# Altium project PCB_Project_1.PrjPcb
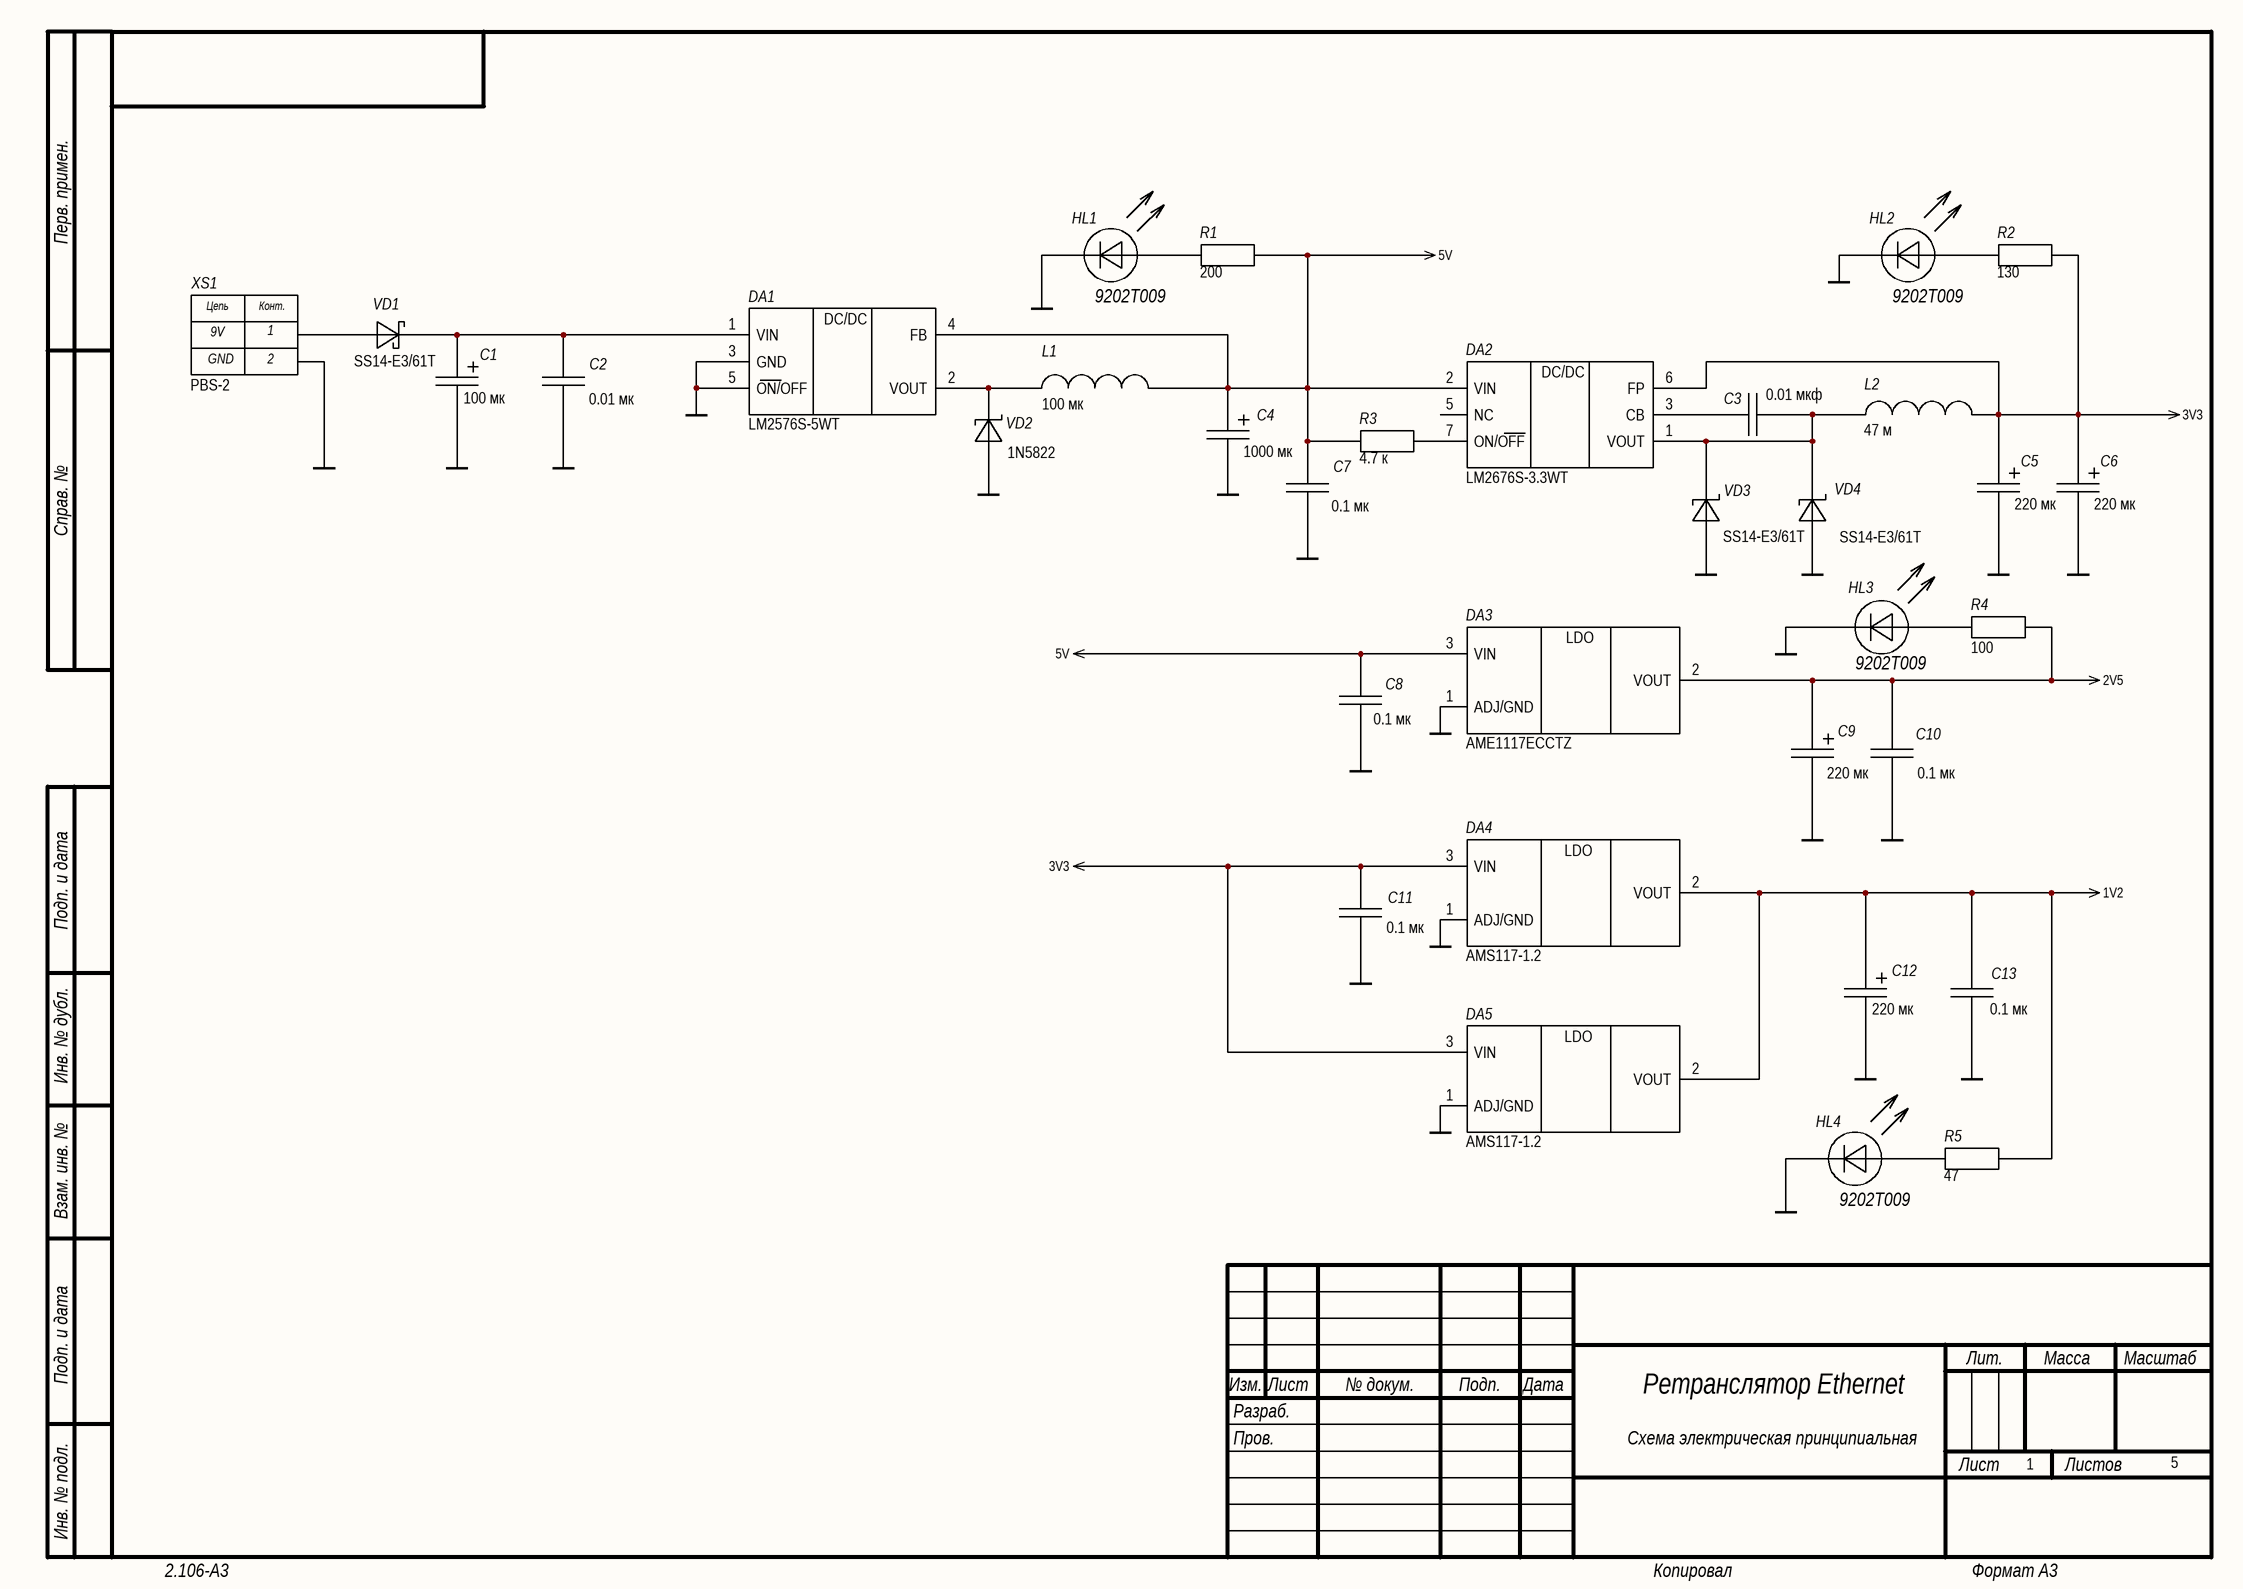
[diagram p0: Power.SchDoc]
5 sheets, 181 parts. Net scope: global (net labels, ports and power ports of the same name join across sheets).
Sheets:
  Power.SchDoc
  Ethernet.SchDoc
  PLIS_POWER.SchDoc
  LCD.SchDoc
  PROGRAM.SchDoc

## Sheet Power.SchDoc
size 420 x 297 mm; CompanyName3: МГТУ им. Н.Э. Баумана; Address1: Address1; Address2: Address2; Address3: Address3; Address4: Address4; DocumentNumber: Э3; Revision: р; SheetNumber: 1; SheetTotal: 5; Title1str: Ретранслятор Ethernet; DocumentType: Схема электрическая принципиальная; FirstReferrence: АБВГ.123456.001; CompanyName2: Кафедра СМ5; CompanyName1: Группа СМ5-71

### Parts
C1  (no value)
C2  (no value)
C3  (no value)
C4  (no value)
C5  (no value)
C6  (no value)
C7  (no value)
C8  (no value)
C9  (no value)
C10  (no value)
C11  (no value)
C12  (no value)
C13  (no value)
DA1  LM2576S-5WT
DA2  LM2676S-3.3WT
DA3  AME1117ECCTZ
DA4  AMS117-1.2
DA5  AMS117-1.2
HL1  9202T009
HL2  9202T009
HL3  9202T009
HL4  9202T009
L1  L  (value not drawn)
L2  L  (value not drawn)
R1  200
R2  130
R3  4.7 к
R4  100
R5  47
VD1  *  (value not drawn)
VD2  *  (value not drawn)
VD3  *  (value not drawn)
VD4  *  (value not drawn)
XS1  Header  (value not drawn)

### Nets
1V2: C12.2 C13.2 DA4.2(VOUT) DA5.2(VOUT) R5.1
2V5: C9.2 C10.2 DA3.2(VOUT) R4.1
3V3: C5.2 C6.2 C11.2 DA2.6(FP) DA4.3(VIN) DA5.3(VIN) L2.2 R2.1
5V: C4.2 C7.2 C8.2 DA1.4(FB) DA2.2(VIN) DA3.3(VIN) L1.2 R1.1 R3.2
GND: C1.1 C2.1 C5.1 C6.1 C7.1 C8.1 C9.1 C10.1 C11.1 C12.1 C13.1 DA1.3(GND) DA1.5(ON/OFF) DA3.1(ADJ/GND) DA4.1(ADJ/GND) DA5.1(ADJ/GND) HL1.2 HL2.2 HL3.2 HL4.2 VD2.1 VD3.1 VD4.1 XS1.2
NetC1_2: C1.2 C2.2 DA1.1(VIN) VD1.2
NetC3_1: C3.1 DA2.1(VOUT) L2.1 VD3.2 VD4.2
NetC3_2: C3.2 DA2.3(CB)
NetDA1_2: DA1.2(VOUT) L1.1 VD2.2
NetDA2_7: DA2.7(ON/OFF) R3.1
NetHL1_1: HL1.1 R1.2
NetHL2_1: HL2.1 R2.2
NetHL3_1: HL3.1 R4.2
NetHL4_1: HL4.1 R5.2
NetVD1_1: VD1.1 XS1.1

Not connected (* = marked no-connect by the designer): C4 1; DA2 5(NC)

### Notes on the sheet
- PBS-2
- SS14-E3/61T
- (near C1) 100 мк
- (near C2) 0.01 мк
- (near VD2) 1N5822
- (near L1) 100 мк
- (near C7) 1000 мк
- (near C3) 0.01 мкф
- (near L2) 47 м
- (near C7) 0.1 мк
- 220 мк
- (near C6) 220 мк
- (near VD4) SS14-E3/61T
- (near C8) 0.1 мк
- (near C10) 0.1 мк
- 0.1 мк
- (near C12) 220 мк
- (near C13) 0.1 мк
- 1
- 5
- Labels drawn without touching a wire or pin: GND
- Перв. примен.
- Справ. №
- Подп. и дата
- Инв. № дубл.
- Взам. инв. №
- Разраб.
- Изм.
- Лист
- № докум.
- Подп.
- Дата
- Ретранслятор Ethernet
- Лит.
- Масса
- Масштаб
- Пров.
- Схема электрическая принципиальная
- Листов
- Инв. № подл.
- 2.106-A3
- Копировал
- Формат А3
- (in symbol AME1117ACCTZ_LDO_1.2v) LDO
- (in symbol AME1117ECCTZ_LDO_1.8v) LDO
- (in symbol Header) Цепь; Конт.; 9V; GND
- (in symbol LM2576_DCDC) DC/DC
- (in symbol LM2676_LDO_3v3) DC/DC

### Library data of the parts
C1 C4-C6 C9 C12 = C_POL: ValueType: Конденсатор
C2 C3 C7 C8 C10 C11 C13 = C: ValueType: Конденсатор
DA1 = LM2576_DCDC
DA2 = LM2676_LDO_3v3
DA3 = AME1117ECCTZ_LDO_1.8v
DA4 DA5 = AME1117ACCTZ_LDO_1.2v
HL1-HL4 = Led_blue: ValueManufacturer: Foryard; ValueManufacturerPartNumber: fyls-0603urc; Temp: -40 C... +85 C; Value: Cиний; ValueType: Светодиод; URL: *; Case: 0603; ValueDescription: Светодиод
R1-R5 = R
VD1 = shotki: ValueManufacturer: On Semiconductor; ValueManufacturerPartNumber: BAT54HT1G; Value: *; URL: *; Temp: *; Case: *; ValueType: *; ValueDescription: *
VD2-VD4 = Diode: ValueManufacturer: On Semiconductor; ValueManufacturerPartNumber: BAT54HT1G; Value: *; URL: *; Temp: *; Case: *; ValueType: *; ValueDescription: *

## Sheet Ethernet.SchDoc
size 420 x 297 mm; Address1: Address1; Address2: Address2; Address3: Address3; Address4: Address4; DocumentNumber: Э3; SheetNumber: 2; SheetTotal: 5; Scale: 1:1; DocumentType: Схема электрическая принципиальная; FirstReferrence: АБВГ.123456.001
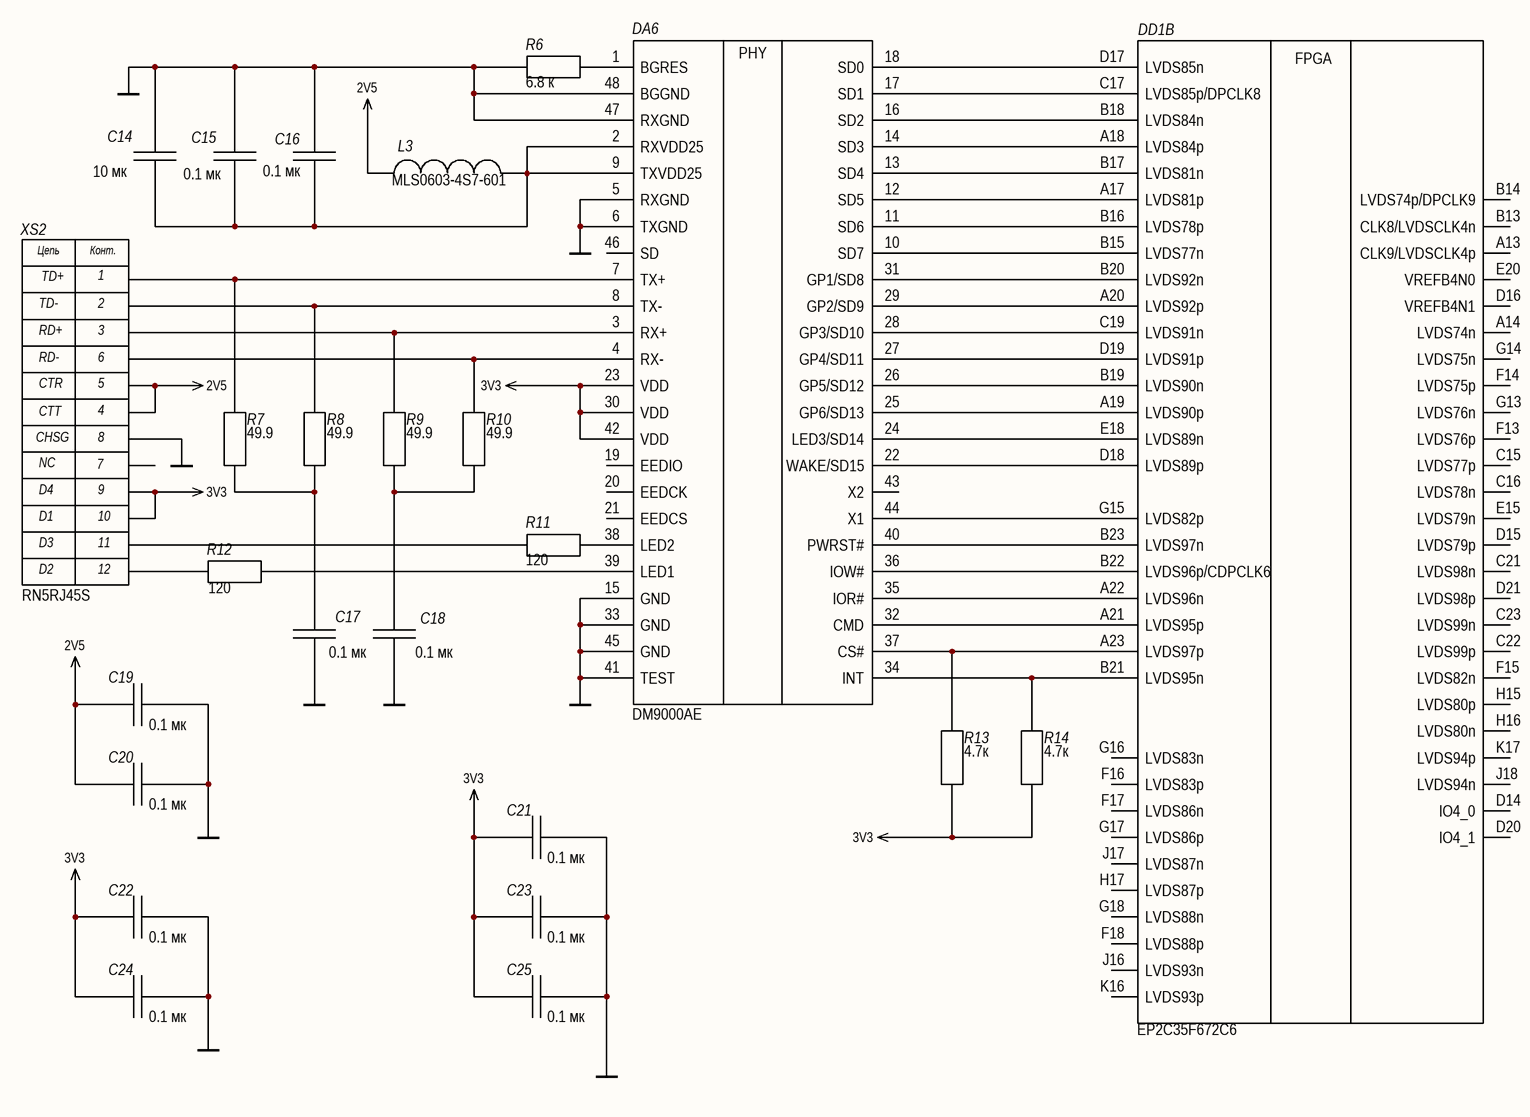
[diagram p1: Ethernet.SchDoc]

### Parts
C14  (no value)
C15  (no value)
C16  (no value)
C17  (no value)
C18  (no value)
C19  (no value)
C20  (no value)
C21  (no value)
C22  (no value)
C23  (no value)
C24  (no value)
C25  (no value)
DA6  DM9000AE
DD1  EP2C35F672C6  (part B of 7)
L3  L  (value not drawn)
R6  6.8 к
R7  49.9
R8  49.9
R9  49.9
R10  49.9
R11  120
R12  120
R13  4.7к
R14  4.7к
XS2  RN5RJ45S

### Nets
2V5: C19.2 C20.2 L3.1 XS2.4 XS2.5
3V3: C21.2 C22.2 C23.2 C24.2 C25.2 DA6.23(VDD) DA6.30(VDD) DA6.42(VDD) R13.1 R14.1 XS2.9 XS2.10
GND: C14.2 C15.2 C16.2 C17.1 C18.1 C19.1 C20.1 C21.1 C22.1 C23.1 C24.1 C25.1 DA6.5(RXGND) DA6.6(TXGND) DA6.15(GND) DA6.33(GND) DA6.41(TEST) DA6.45(GND) DA6.47(RXGND) DA6.48(BGGND) R6.1 XS2.8
NetC14_1: C14.1 C15.1 C16.1 DA6.2(RXVDD25) DA6.9(TXVDD25) L3.2
NetC17_2: C17.2 R7.1 R8.1
NetC18_2: C18.2 R9.1 R10.1
NetDA6_1: DA6.1(BGRES) R6.2
NetDA6_3: DA6.3(RX+) R9.2 XS2.3
NetDA6_4: DA6.4(RX-) R10.2 XS2.6
NetDA6_7: DA6.7(TX+) R7.2 XS2.1
NetDA6_8: DA6.8(TX-) R8.2 XS2.2
NetDA6_10: DA6.10(SD7) DD1.B15(LVDS77n)
NetDA6_11: DA6.11(SD6) DD1.B16(LVDS78p)
NetDA6_12: DA6.12(SD5) DD1.A17(LVDS81p)
NetDA6_13: DA6.13(SD4) DD1.B17(LVDS81n)
NetDA6_14: DA6.14(SD3) DD1.A18(LVDS84p)
NetDA6_16: DA6.16(SD2) DD1.B18(LVDS84n)
NetDA6_17: DA6.17(SD1) DD1.C17(LVDS85p/DPCLK8)
NetDA6_18: DA6.18(SD0) DD1.D17(LVDS85n)
NetDA6_22: DA6.22(WAKE/SD15) DD1.D18(LVDS89p)
NetDA6_24: DA6.24(LED3/SD14) DD1.E18(LVDS89n)
NetDA6_25: DA6.25(GP6/SD13) DD1.A19(LVDS90p)
NetDA6_26: DA6.26(GP5/SD12) DD1.B19(LVDS90n)
NetDA6_27: DA6.27(GP4/SD11) DD1.D19(LVDS91p)
NetDA6_28: DA6.28(GP3/SD10) DD1.C19(LVDS91n)
NetDA6_29: DA6.29(GP2/SD9) DD1.A20(LVDS92p)
NetDA6_31: DA6.31(GP1/SD8) DD1.B20(LVDS92n)
NetDA6_32: DA6.32(CMD) DD1.A21(LVDS95p)
NetDA6_34: DA6.34(INT) DD1.B21(LVDS95n) R14.2
NetDA6_35: DA6.35(IOR#) DD1.A22(LVDS96n)
NetDA6_36: DA6.36(IOW#) DD1.B22(LVDS96p/CDPCLK6)
NetDA6_37: DA6.37(CS#) DD1.A23(LVDS97p) R13.2
NetDA6_38: DA6.38(LED2) R11.2
NetDA6_39: DA6.39(LED1) R12.2
NetDA6_40: DA6.40(PWRST#) DD1.B23(LVDS97n)
NetDA6_44: DA6.44(X1) DD1.G15(LVDS82p)
NetR11_1: R11.1 XS2.11
NetR12_1: R12.1 XS2.12

Not connected (* = marked no-connect by the designer): DA6 19(EEDIO) 20(EEDCK) 21(EEDCS) 43(X2) 46(SD); DD1 A13(CLK9/LVDSCLK4p) A14(LVDS74n) B13(CLK8/LVDSCLK4n) B14(LVDS74p/DPCLK9) C15(LVDS77p) C16(LVDS78n) C21(LVDS98n) C22(LVDS99p) C23(LVDS99n) D14(IO4_0) D15(LVDS79p) D16(VREFB4N1) D20(IO4_1) D21(LVDS98p) E15(LVDS79n) E20(VREFB4N0) F13(LVDS76p) F14(LVDS75p) F15(LVDS82n) F16(LVDS83p) F17(LVDS86n) F18(LVDS88p) G13(LVDS76n) G14(LVDS75n) G16(LVDS83n) G17(LVDS86p) G18(LVDS88n) H15(LVDS80p) H16(LVDS80n) H17(LVDS87p) J16(LVDS93n) J17(LVDS87n) J18(LVDS94n) K16(LVDS93p) K17(LVDS94p); XS2 7

### Notes on the sheet
- (near C14) 10 мк
- (near C15) 0.1 мк
- (near C16) 0.1 мк
- (near L3) MLS0603-4S7-601
- 0.1 мк
- (near C18) 0.1 мк
- (near C19) 0.1 мк
- (near C20) 0.1 мк
- (near C21) 0.1 мк
- (near C22) 0.1 мк
- (near C23) 0.1 мк
- (near C24) 0.1 мк
- (near C25) 0.1 мк
- Подп. и дата
- Инв. № дубл.
- Взам. инв. №
- Инв. № подл.
- Изм.
- Лист
- № докум.
- Подп.
- Дата
- 2.106-A3
- Копировал
- Формат А3
- (in symbol DM9000AE) PHY
- (in symbol Ethernet_RJ45) Цепь; Конт.; TD+; TD-; RD+; RD-; CTR; CTT; CHSG; NC; D4; D1; D3; D2
- (in symbol PLIS, part B) FPGA

### Library data of the parts
C14-C25 = C: ValueType: Конденсатор
DD1 = PLIS
R6-R14 = R
XS2 = Ethernet_RJ45

## Sheet PLIS_POWER.SchDoc
size 420 x 297 mm; Address1: Address1; Address2: Address2; Address3: Address3; Address4: Address4; DocumentNumber: Э3; SheetNumber: 3; SheetTotal: 5; Scale: 1:1; DocumentType: Схема электрическая принципиальная; FirstReferrence: АБВГ.123456.001
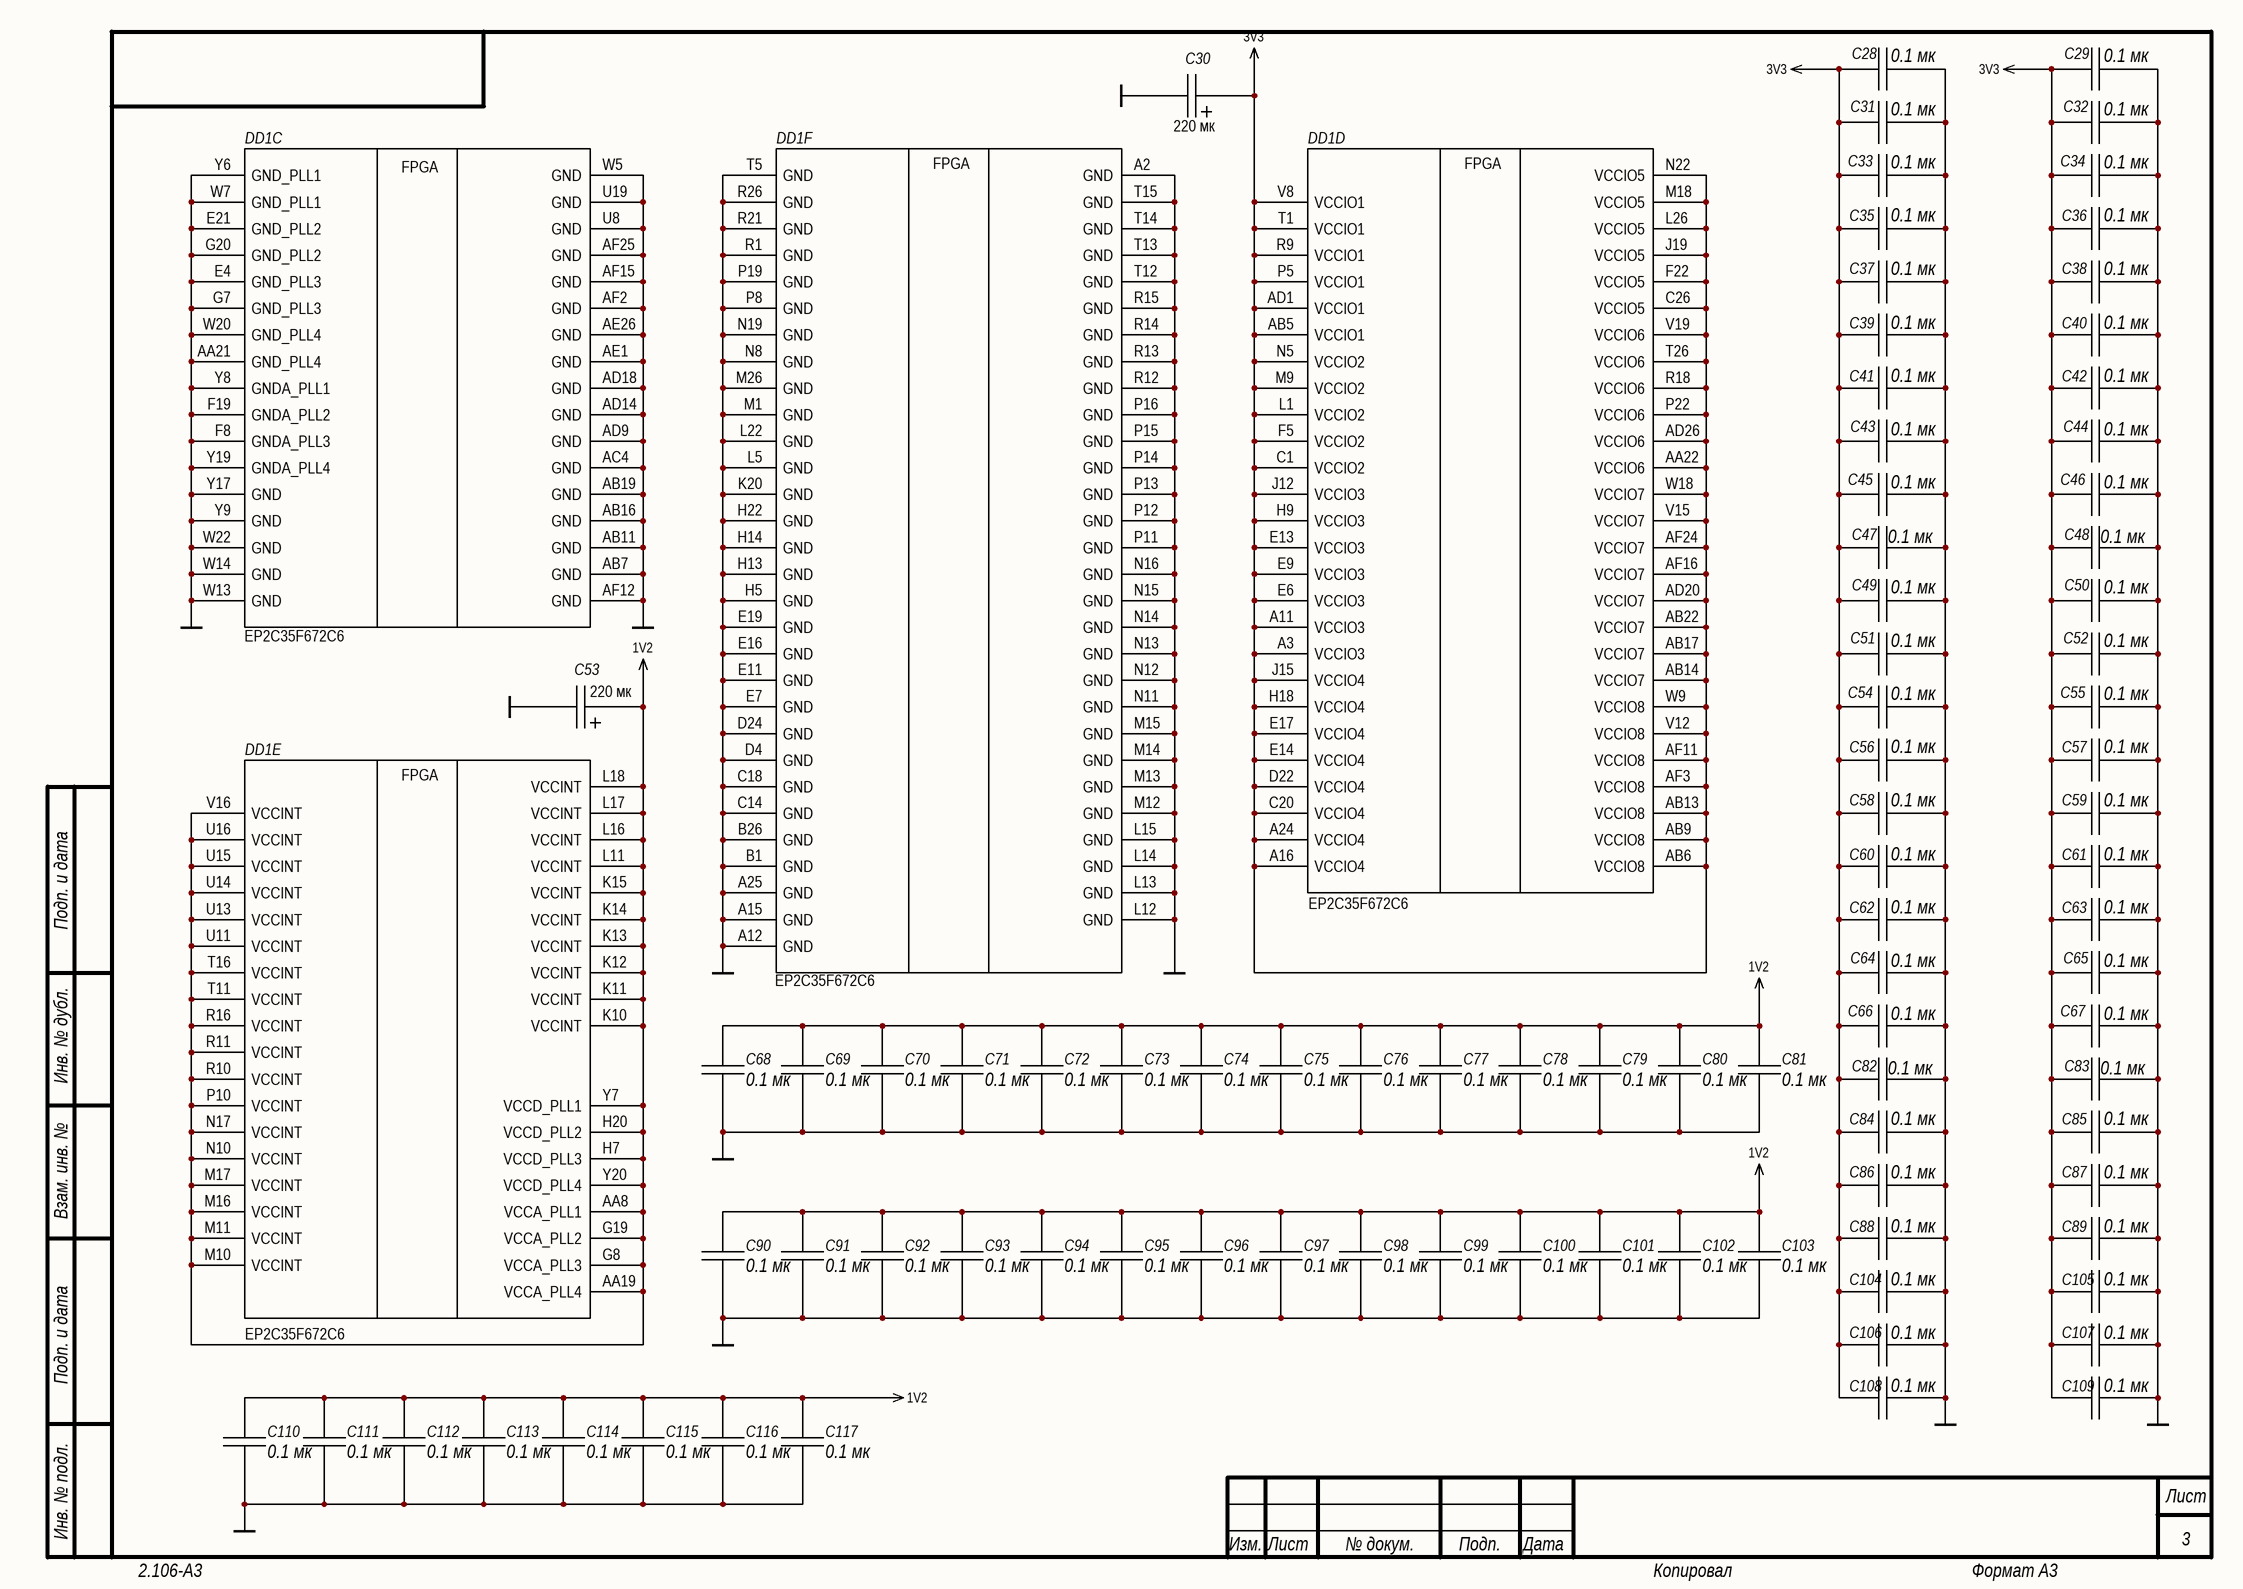
[diagram p2: PLIS_POWER.SchDoc]

### Parts
C28  0.1 мк
C29  0.1 мк
C30  (no value)
C31  0.1 мк
C32  0.1 мк
C33  0.1 мк
C34  0.1 мк
C35  0.1 мк
C36  0.1 мк
C37  0.1 мк
C38  0.1 мк
C39  0.1 мк
C40  0.1 мк
C41  0.1 мк
C42  0.1 мк
C43  0.1 мк
C44  0.1 мк
C45  0.1 мк
C46  0.1 мк
C47  0.1 мк
C48  0.1 мк
C49  0.1 мк
C50  0.1 мк
C51  0.1 мк
C52  0.1 мк
C53  (no value)
C54  0.1 мк
C55  0.1 мк
C56  0.1 мк
C57  0.1 мк
C58  0.1 мк
C59  0.1 мк
C60  0.1 мк
C61  0.1 мк
C62  0.1 мк
C63  0.1 мк
C64  0.1 мк
C65  0.1 мк
C66  0.1 мк
C67  0.1 мк
C68  0.1 мк
C69  0.1 мк
C70  0.1 мк
C71  0.1 мк
C72  0.1 мк
C73  0.1 мк
C74  0.1 мк
C75  0.1 мк
C76  0.1 мк
C77  0.1 мк
C78  0.1 мк
C79  0.1 мк
C80  0.1 мк
C81  0.1 мк
C82  0.1 мк
C83  0.1 мк
C84  0.1 мк
C85  0.1 мк
C86  0.1 мк
C87  0.1 мк
C88  0.1 мк
C89  0.1 мк
C90  0.1 мк
C91  0.1 мк
C92  0.1 мк
C93  0.1 мк
C94  0.1 мк
C95  0.1 мк
C96  0.1 мк
C97  0.1 мк
C98  0.1 мк
C99  0.1 мк
C100  0.1 мк
C101  0.1 мк
C102  0.1 мк
C103  0.1 мк
C104  0.1 мк
C105  0.1 мк
C106  0.1 мк
C107  0.1 мк
C108  0.1 мк
C109  0.1 мк
C110  0.1 мк
C111  0.1 мк
C112  0.1 мк
C113  0.1 мк
C114  0.1 мк
C115  0.1 мк
C116  0.1 мк
C117  0.1 мк
DD1  EP2C35F672C6  (parts C,D,E,F of 7)

### Nets
1V2: C53.2 C68.1 C69.1 C70.1 C71.1 C72.1 C73.1 C74.1 C75.1 C76.1 C77.1 C78.1 C79.1 C80.1 C81.1 C90.1 C91.1 C92.1 C93.1 C94.1 C95.1 C96.1 C97.1 C98.1 C99.1 C100.1 C101.1 C102.1 C103.1 C110.1 C111.1 C112.1 C113.1 C114.1 C115.1 C116.1 C117.1 DD1.AA8(VCCA_PLL1) DD1.AA19(VCCA_PLL4) DD1.G8(VCCA_PLL3) DD1.G19(VCCA_PLL2) DD1.H7(VCCD_PLL3) DD1.H20(VCCD_PLL2) DD1.K10(VCCINT) DD1.K11(VCCINT) DD1.K12(VCCINT) DD1.K13(VCCINT) DD1.K14(VCCINT) DD1.K15(VCCINT) DD1.L11(VCCINT) DD1.L16(VCCINT) DD1.L17(VCCINT) DD1.L18(VCCINT) DD1.M10(VCCINT) DD1.M11(VCCINT) DD1.M16(VCCINT) DD1.M17(VCCINT) DD1.N10(VCCINT) DD1.N17(VCCINT) DD1.P10(VCCINT) DD1.R10(VCCINT) DD1.R11(VCCINT) DD1.R16(VCCINT) DD1.T11(VCCINT) DD1.T16(VCCINT) DD1.U11(VCCINT) DD1.U13(VCCINT) DD1.U14(VCCINT) DD1.U15(VCCINT) DD1.U16(VCCINT) DD1.V16(VCCINT) DD1.Y7(VCCD_PLL1) DD1.Y20(VCCD_PLL4)
3V3: C28.1 C29.1 C30.2 C31.1 C32.1 C33.1 C34.1 C35.1 C36.1 C37.1 C38.1 C39.1 C40.1 C41.1 C42.1 C43.1 C44.1 C45.1 C46.1 C47.1 C48.1 C49.1 C50.1 C51.1 C52.1 C54.1 C55.1 C56.1 C57.1 C58.1 C59.1 C60.1 C61.1 C62.1 C63.1 C64.1 C65.1 C66.1 C67.1 C82.1 C83.1 C84.1 C85.1 C86.1 C87.1 C88.1 C89.1 C104.1 C105.1 C106.1 C107.1 C108.1 C109.1 DD1.A3(VCCIO3) DD1.A11(VCCIO3) DD1.A16(VCCIO4) DD1.A24(VCCIO4) DD1.AA22(VCCIO6) DD1.AB5(VCCIO1) DD1.AB6(VCCIO8) DD1.AB9(VCCIO8) DD1.AB13(VCCIO8) DD1.AB14(VCCIO7) DD1.AB17(VCCIO7) DD1.AB22(VCCIO7) DD1.AD1(VCCIO1) DD1.AD20(VCCIO7) DD1.AD26(VCCIO6) DD1.AF3(VCCIO8) DD1.AF11(VCCIO8) DD1.AF16(VCCIO7) DD1.AF24(VCCIO7) DD1.C1(VCCIO2) DD1.C20(VCCIO4) DD1.C26(VCCIO5) DD1.D22(VCCIO4) DD1.E6(VCCIO3) DD1.E9(VCCIO3) DD1.E13(VCCIO3) DD1.E14(VCCIO4) DD1.E17(VCCIO4) DD1.F5(VCCIO2) DD1.F22(VCCIO5) DD1.H9(VCCIO3) DD1.H18(VCCIO4) DD1.J12(VCCIO3) DD1.J15(VCCIO4) DD1.J19(VCCIO5) DD1.L1(VCCIO2) DD1.L26(VCCIO5) DD1.M9(VCCIO2) DD1.M18(VCCIO5) DD1.N5(VCCIO2) DD1.N22(VCCIO5) DD1.P5(VCCIO1) DD1.P22(VCCIO6) DD1.R9(VCCIO1) DD1.R18(VCCIO6) DD1.T1(VCCIO1) DD1.T26(VCCIO6) DD1.V8(VCCIO1) DD1.V12(VCCIO8) DD1.V15(VCCIO7) DD1.V19(VCCIO6) DD1.W9(VCCIO8) DD1.W18(VCCIO7)
GND: C28.2 C29.2 C30.1 C31.2 C32.2 C33.2 C34.2 C35.2 C36.2 C37.2 C38.2 C39.2 C40.2 C41.2 C42.2 C43.2 C44.2 C45.2 C46.2 C47.2 C48.2 C49.2 C50.2 C51.2 C52.2 C53.1 C54.2 C55.2 C56.2 C57.2 C58.2 C59.2 C60.2 C61.2 C62.2 C63.2 C64.2 C65.2 C66.2 C67.2 C68.2 C69.2 C70.2 C71.2 C72.2 C73.2 C74.2 C75.2 C76.2 C77.2 C78.2 C79.2 C80.2 C81.2 C82.2 C83.2 C84.2 C85.2 C86.2 C87.2 C88.2 C89.2 C90.2 C91.2 C92.2 C93.2 C94.2 C95.2 C96.2 C97.2 C98.2 C99.2 C100.2 C101.2 C102.2 C103.2 C104.2 C105.2 C106.2 C107.2 C108.2 C109.2 C110.2 C111.2 C112.2 C113.2 C114.2 C115.2 C116.2 C117.2 DD1.A2(GND) DD1.A12(GND) DD1.A15(GND) DD1.A25(GND) DD1.AA21(GND_PLL4) DD1.AB7(GND) DD1.AB11(GND) DD1.AB16(GND) DD1.AB19(GND) DD1.AC4(GND) DD1.AD9(GND) DD1.AD14(GND) DD1.AD18(GND) DD1.AE1(GND) DD1.AE26(GND) DD1.AF2(GND) DD1.AF12(GND) DD1.AF15(GND) DD1.AF25(GND) DD1.B1(GND) DD1.B26(GND) DD1.C14(GND) DD1.C18(GND) DD1.D4(GND) DD1.D24(GND) DD1.E4(GND_PLL3) DD1.E7(GND) DD1.E11(GND) DD1.E16(GND) DD1.E19(GND) DD1.E21(GND_PLL2) DD1.F8(GNDA_PLL3) DD1.F19(GNDA_PLL2) DD1.G7(GND_PLL3) DD1.G20(GND_PLL2) DD1.H5(GND) DD1.H13(GND) DD1.H14(GND) DD1.H22(GND) DD1.K20(GND) DD1.L5(GND) DD1.L12(GND) DD1.L13(GND) DD1.L14(GND) DD1.L15(GND) DD1.L22(GND) DD1.M1(GND) DD1.M12(GND) DD1.M13(GND) DD1.M14(GND) DD1.M15(GND) DD1.M26(GND) DD1.N8(GND) DD1.N11(GND) DD1.N12(GND) DD1.N13(GND) DD1.N14(GND) DD1.N15(GND) DD1.N16(GND) DD1.N19(GND) DD1.P8(GND) DD1.P11(GND) DD1.P12(GND) DD1.P13(GND) DD1.P14(GND) DD1.P15(GND) DD1.P16(GND) DD1.P19(GND) DD1.R1(GND) DD1.R12(GND) DD1.R13(GND) DD1.R14(GND) DD1.R15(GND) DD1.R21(GND) DD1.R26(GND) DD1.T5(GND) DD1.T12(GND) DD1.T13(GND) DD1.T14(GND) DD1.T15(GND) DD1.U8(GND) DD1.U19(GND) DD1.W5(GND) DD1.W7(GND_PLL1) DD1.W13(GND) DD1.W14(GND) DD1.W20(GND_PLL4) DD1.W22(GND) DD1.Y6(GND_PLL1) DD1.Y8(GNDA_PLL1) DD1.Y9(GND) DD1.Y17(GND) DD1.Y19(GNDA_PLL4)

### Notes on the sheet
- (near C30) 220 мк
- (near C53) 220 мк
- Подп. и дата
- Инв. № дубл.
- Взам. инв. №
- Инв. № подл.
- Изм.
- Лист
- № докум.
- Подп.
- Дата
- 2.106-A3
- Копировал
- Формат А3
- (in symbol PLIS, part C) FPGA
- (in symbol PLIS, part D) FPGA
- (in symbol PLIS, part E) FPGA
- (in symbol PLIS, part F) FPGA

### Library data of the parts
C28 C29 C31-C52 C54-C117 = C: ValueType: Конденсатор
C30 C53 = C_POL: ValueType: Конденсатор
DD1 = PLIS

## Sheet LCD.SchDoc
size 420 x 297 mm; Address1: Address1; Address2: Address2; Address3: Address3; Address4: Address4; DocumentNumber: Э3; SheetNumber: 4; SheetTotal: 5; Scale: 1:1; DocumentType: Схема электрическая принципиальная; FirstReferrence: АБВГ.123456.001
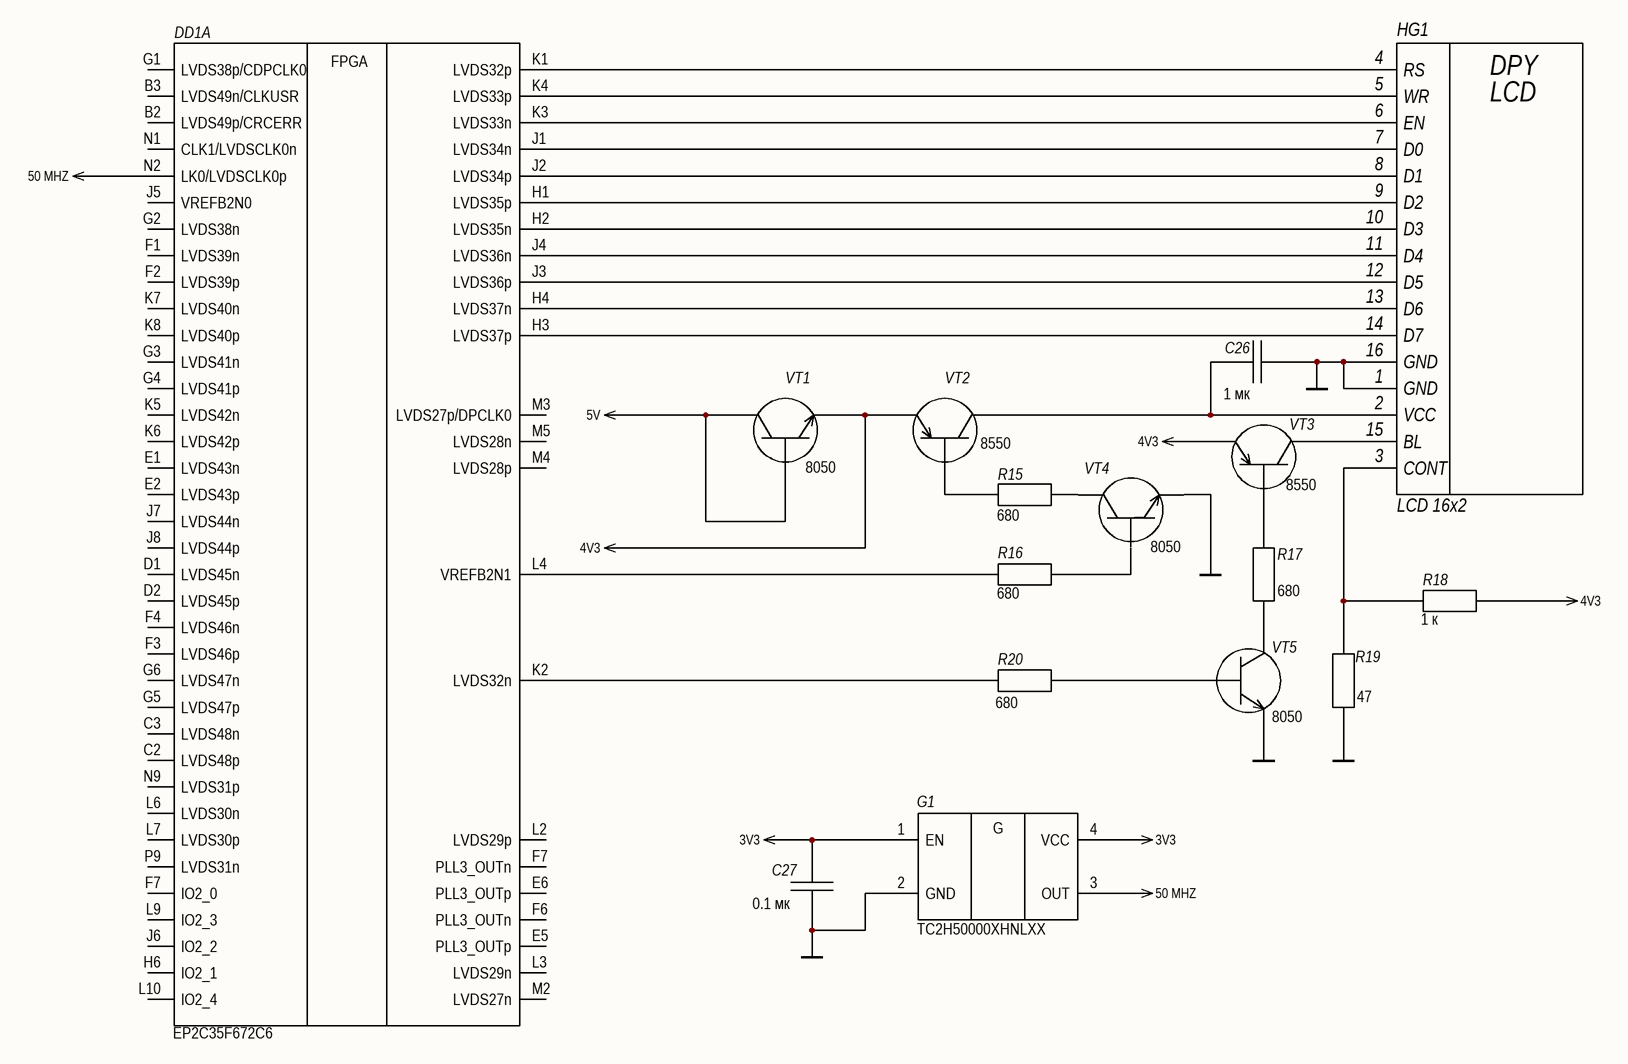
[diagram p3: LCD.SchDoc]

### Parts
C26  (no value)
C27  (no value)
DD1  EP2C35F672C6  (part A of 7)
G1  TC2H50000XHNLXX
HG1  LCD 16x2
R15  (no value)
R16  (no value)
R17  (no value)
R18  (no value)
R19  (no value)
R20  (no value)
VT1  Transistor  (value not drawn)
VT2  Transistor  (value not drawn)
VT3  Transistor  (value not drawn)
VT4  Transistor  (value not drawn)
VT5  Transistor  (value not drawn)

### Nets
3V3: C27.2 DD1.E6(PLL3_OUTp) G1.1(EN) G1.4(VCC)
4V3: R18.2 VT1.2 VT2.2 VT3.2
5V: VT1.1 VT1.3
50 MHZ: DD1.N2(LK0/LVDSCLK0p) G1.3(OUT)
GND: C26.1 C27.1 G1.2(GND) HG1.1(GND) HG1.16(GND) R19.1 VT4.2 VT5.2
NetC26_2: C26.2 HG1.2(VCC) VT2.3
NetDD1_H1: DD1.H1(LVDS35p) HG1.9(D2)
NetDD1_H2: DD1.H2(LVDS35n) HG1.10(D3)
NetDD1_H3: DD1.H3(LVDS37p) HG1.14(D7)
NetDD1_H4: DD1.H4(LVDS37n) HG1.13(D6)
NetDD1_J1: DD1.J1(LVDS34n) HG1.7(D0)
NetDD1_J2: DD1.J2(LVDS34p) HG1.8(D1)
NetDD1_J3: DD1.J3(LVDS36p) HG1.12(D5)
NetDD1_J4: DD1.J4(LVDS36n) HG1.11(D4)
NetDD1_K1: DD1.K1(LVDS32p) HG1.4(RS)
NetDD1_K2: DD1.K2(LVDS32n) R20.1
NetDD1_K3: DD1.K3(LVDS33n) HG1.6(EN)
NetDD1_K4: DD1.K4(LVDS33p) HG1.5(WR)
NetDD1_L4: DD1.L4(VREFB2N1) R16.2
NetHG1_3: HG1.3(CONT) R18.1 R19.2
NetHG1_15: HG1.15(BL) VT3.3
NetR15_1: R15.1 VT4.3
NetR15_2: R15.2 VT2.1
NetR16_1: R16.1 VT4.1
NetR17_1: R17.1 VT5.3
NetR17_2: R17.2 VT3.1
NetR20_2: R20.2 VT5.1

Not connected (* = marked no-connect by the designer): DD1 B2(LVDS49p/CRCERR) B3(LVDS49n/CLKUSR) C2(LVDS48p) C3(LVDS48n) D1(LVDS45n) D2(LVDS45p) E1(LVDS43n) E2(LVDS43p) E5(PLL3_OUTp) F1(LVDS39n) F2(LVDS39p) F3(LVDS46p) F4(LVDS46n) F6(PLL3_OUTn) F7(IO2_0) G1(LVDS38p/CDPCLK0) G2(LVDS38n) G3(LVDS41n) G4(LVDS41p) G5(LVDS47p) G6(LVDS47n) H6(IO2_1) J5(VREFB2N0) J6(IO2_2) J7(LVDS44n) J8(LVDS44p) K5(LVDS42n) K6(LVDS42p) K7(LVDS40n) K8(LVDS40p) L2(LVDS29p) L3(LVDS29n) L6(LVDS30n) L7(LVDS30p) L9(IO2_3) L10(IO2_4) M2(LVDS27n) M3(LVDS27p/DPCLK0) M4(LVDS28p) M5(LVDS28n) N1(CLK1/LVDSCLK0n) N9(LVDS31p) P9(LVDS31n)

### Notes on the sheet
- 1 мк
- (near VT1) 8050
- (near VT2) 8550
- (near VT3) 8550
- (near R15) 680
- (near VT4) 8050
- (near R16) 680
- (near R17) 680
- (near R18) 1 к
- (near R20) 680
- (near VT5) 8050
- (near R19) 47
- (near C27) 0.1 мк
- Подп. и дата
- Инв. № дубл.
- Взам. инв. №
- Инв. № подл.
- Изм.
- Лист
- № докум.
- Подп.
- Дата
- 2.106-A3
- Копировал
- Формат А3
- (in symbol Generator) G
- (in symbol LCD Display) DPY; LCD
- (in symbol PLIS, part A) FPGA

### Library data of the parts
C26 C27 = C: ValueType: Конденсатор
DD1 = PLIS
G1 = Generator
HG1 = LCD Display
R15-R20 = R

## Sheet PROGRAM.SchDoc
size 420 x 297 mm; Address1: Address1; Address2: Address2; Address3: Address3; Address4: Address4; DocumentNumber: Э3; SheetNumber: 5; SheetTotal: 5; Scale: 1:1; DocumentType: Схема электрическая принципиальная; FirstReferrence: АБВГ.123456.001
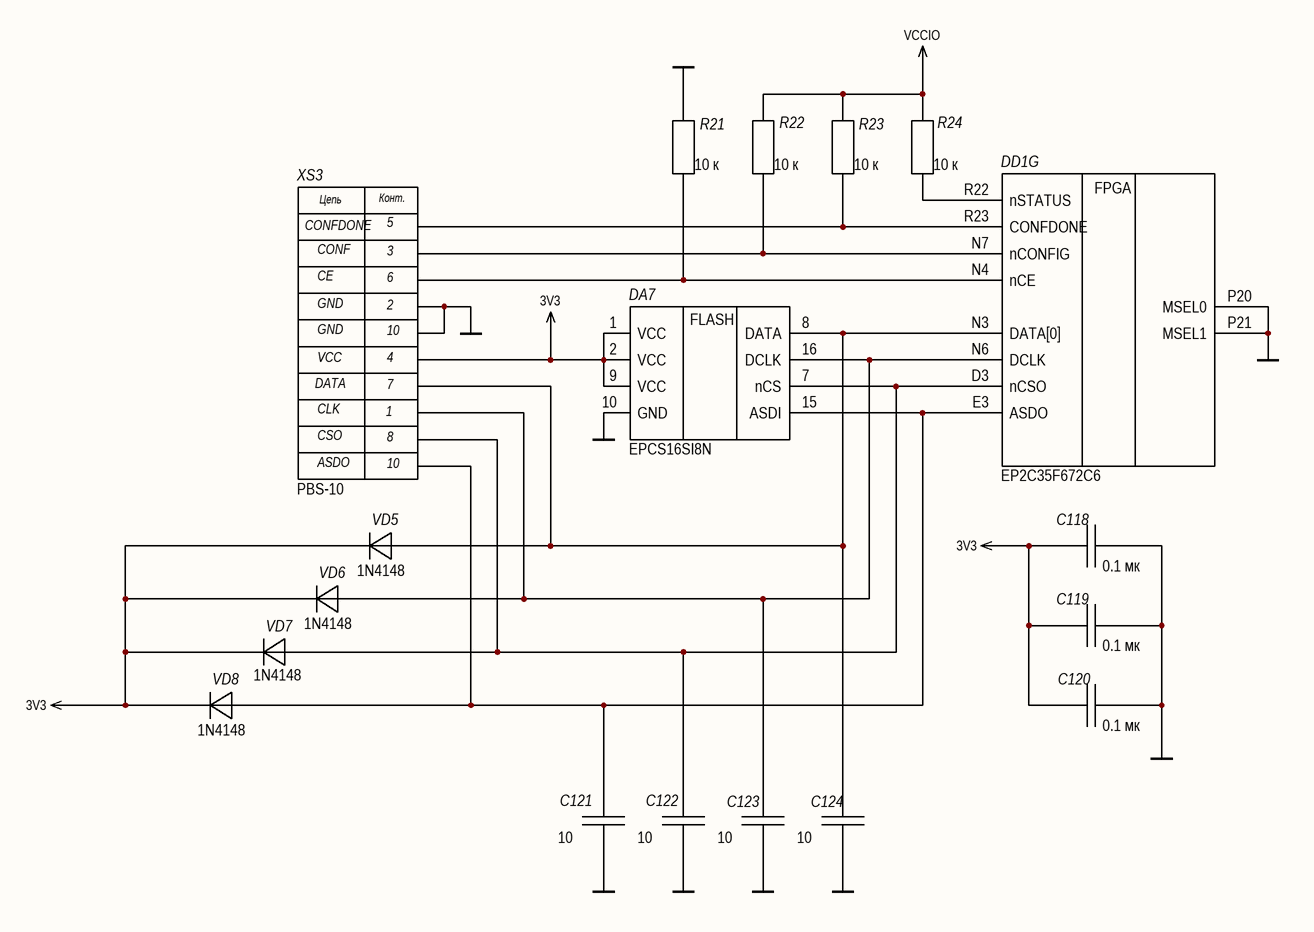
[diagram p4: PROGRAM.SchDoc]

### Parts
C118  (no value)
C119  (no value)
C120  (no value)
C121  (no value)
C122  (no value)
C123  (no value)
C124  (no value)
DA7  EPCS16SI8N
DD1  EP2C35F672C6  (part G of 7)
R21  (no value)
R22  (no value)
R23  (no value)
R24  (no value)
VD5  *  (value not drawn)
VD6  *  (value not drawn)
VD7  *  (value not drawn)
VD8  *  (value not drawn)
XS3  PBS-10

### Nets
3V3: C118.2 C119.2 C120.2 DA7.1(VCC) DA7.2(VCC) DA7.9(VCC) VD5.2 VD6.2 VD7.2 VD8.2 XS3.4
GND: C118.1 C119.1 C120.1 C121.1 C122.1 C123.1 C124.1 DA7.10(GND) DD1.P20(MSEL0) DD1.P21(MSEL1) R21.2 XS3.5 XS3.6
VCCIO: R22.2 R23.2 R24.2
NetC121_2: C121.2 DA7.15(ASDI) DD1.E3(ASDO) VD8.1 XS3.10
NetC122_2: C122.2 DA7.7(nCS) DD1.D3(nCSO) VD7.1 XS3.9
NetC123_2: C123.2 DA7.16(DCLK) DD1.N6(DCLK) VD6.1 XS3.7
NetC124_2: C124.2 DA7.8(DATA) DD1.N3(DATA[0]) VD5.1 XS3.8
NetDD1_N4: DD1.N4(nCE) R21.1 XS3.3
NetDD1_N7: DD1.N7(nCONFIG) R22.1 XS3.2
NetDD1_R22: DD1.R22(nSTATUS) R24.1
NetDD1_R23: DD1.R23(CONFDONE) R23.1 XS3.5(CONFDONE)

### Notes on the sheet
- (near R21) 10 к
- (near R22) 10 к
- (near R23) 10 к
- (near R24) 10 к
- 1N4148
- (near C118) 0.1 мк
- (near VD7) 1N4148
- (near C119) 0.1 мк
- (near VD8) 1N4148
- (near C120) 0.1 мк
- (near C121) 10
- 10
- Подп. и дата
- Инв. № дубл.
- Взам. инв. №
- Инв. № подл.
- Изм.
- Лист
- № докум.
- Подп.
- Дата
- 2.106-A3
- Копировал
- Формат А3
- (in symbol EPCS16) FLASH
- (in symbol HEADER 10PIN) Конт.; Цепь; CONF; CE; GND; VCC; DATA; CLK; 1; CSO; ASDO
- (in symbol PLIS, part G) FPGA

### Library data of the parts
C118-C124 = C: ValueType: Конденсатор
DA7 = EPCS16
DD1 = PLIS
R21-R24 = R
VD5-VD8 = diode: ValueManufacturer: On Semiconductor; ValueManufacturerPartNumber: BAT54HT1G; Value: *; URL: *; Temp: *; Case: *; ValueType: *; ValueDescription: *
XS3 = HEADER 10PIN

## Nets that join several sheets
1V2: Power (5 pins), PLIS_POWER (73 pins)
2V5: Power (C9.2 C10.2 DA3.2 R4.1), Ethernet (5 pins)
3V3: Power (8 pins), Ethernet (12 pins), PLIS_POWER (106 pins), LCD (C27.2 DD1.E6 G1.1 G1.4), PROGRAM (11 pins)
5V: Power (9 pins), LCD (VT1.1 VT1.3)
GND: Power (24 pins), Ethernet (22 pins), PLIS_POWER (183 pins), LCD (8 pins), PROGRAM (13 pins)